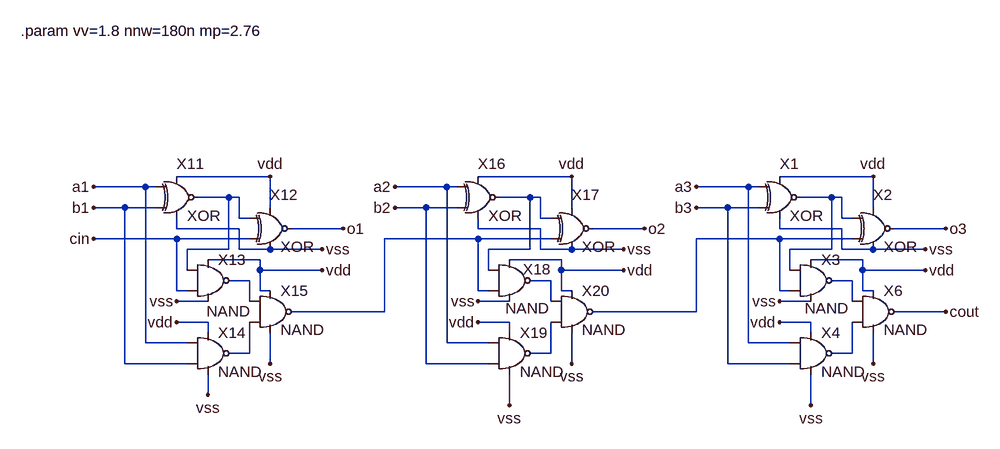
[diagram p0: schematic add3b.asc]
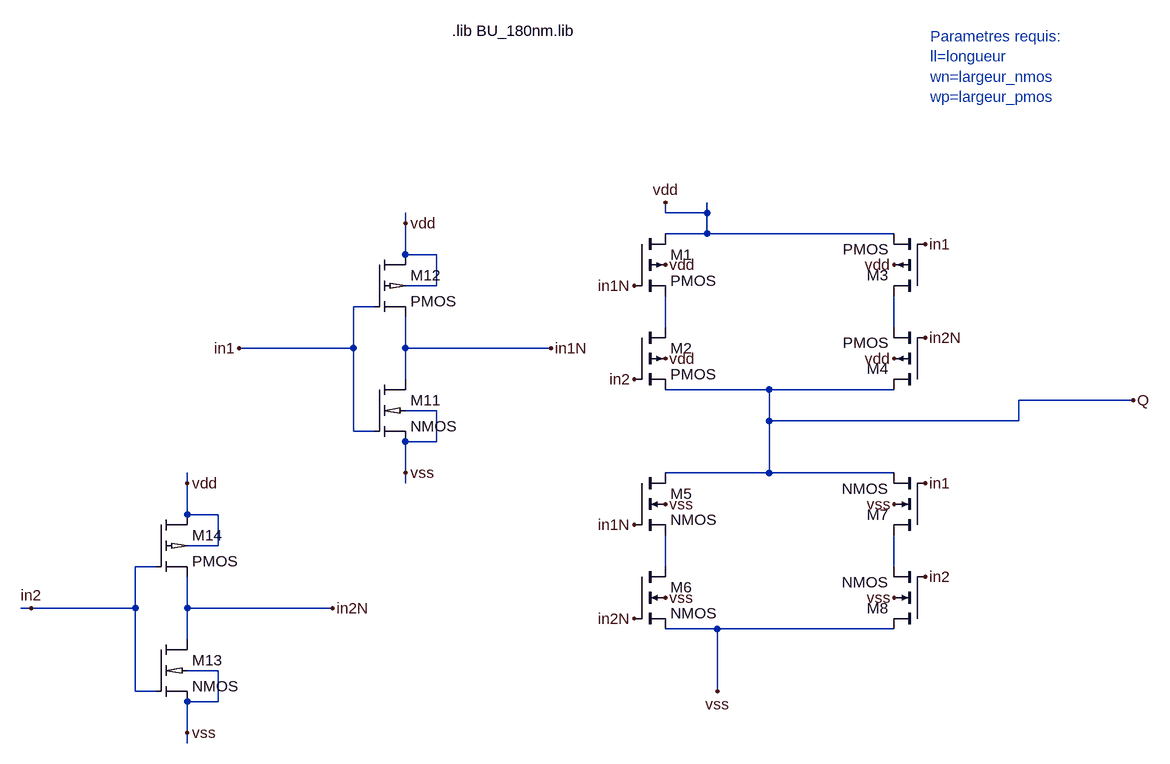
[diagram p1: sub-circuit xor.asc]
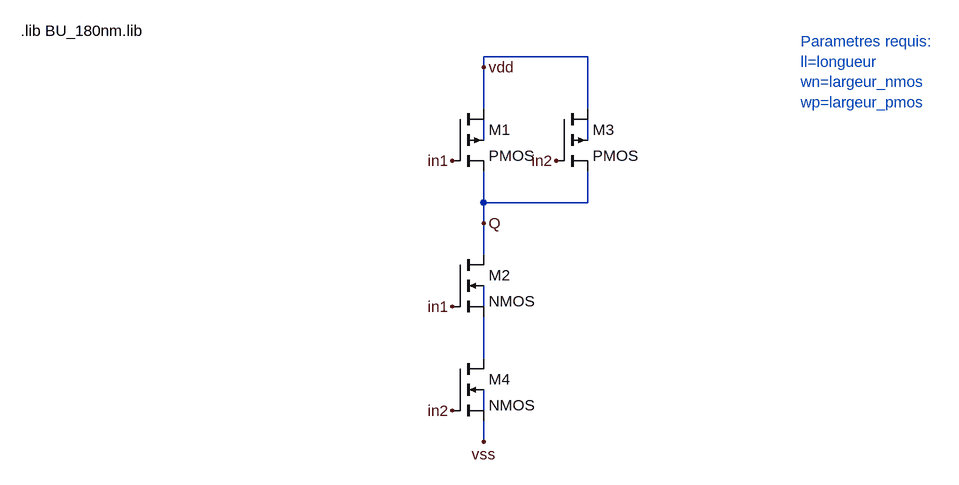
[diagram p2: sub-circuit nand.asc]
add3b.asc, the LTspice schematic file:
Version 4
SHEET 1 2196 1352
WIRE 320 -352 176 -352
WIRE 784 -352 640 -352
WIRE 1248 -352 1104 -352
WIRE 128 -336 48 -336
WIRE 144 -336 128 -336
WIRE 592 -336 512 -336
WIRE 608 -336 592 -336
WIRE 1056 -336 976 -336
WIRE 1072 -336 1056 -336
WIRE 256 -320 208 -320
WIRE 272 -320 256 -320
WIRE 720 -320 672 -320
WIRE 736 -320 720 -320
WIRE 1184 -320 1136 -320
WIRE 1200 -320 1184 -320
WIRE 96 -304 48 -304
WIRE 144 -304 96 -304
WIRE 320 -304 320 -352
WIRE 560 -304 512 -304
WIRE 608 -304 560 -304
WIRE 784 -304 784 -352
WIRE 1024 -304 976 -304
WIRE 1072 -304 1024 -304
WIRE 1248 -304 1248 -352
WIRE 272 -288 272 -320
WIRE 288 -288 272 -288
WIRE 736 -288 736 -320
WIRE 752 -288 736 -288
WIRE 1200 -288 1200 -320
WIRE 1216 -288 1200 -288
WIRE 176 -272 176 -288
WIRE 272 -272 176 -272
WIRE 432 -272 352 -272
WIRE 640 -272 640 -288
WIRE 736 -272 640 -272
WIRE 896 -272 816 -272
WIRE 1104 -272 1104 -288
WIRE 1200 -272 1104 -272
WIRE 1360 -272 1280 -272
WIRE 176 -256 48 -256
WIRE 288 -256 176 -256
WIRE 640 -256 496 -256
WIRE 752 -256 640 -256
WIRE 1104 -256 976 -256
WIRE 1216 -256 1104 -256
WIRE 256 -240 256 -320
WIRE 256 -240 192 -240
WIRE 272 -240 272 -272
WIRE 320 -240 272 -240
WIRE 400 -240 320 -240
WIRE 720 -240 720 -320
WIRE 720 -240 656 -240
WIRE 736 -240 736 -272
WIRE 784 -240 736 -240
WIRE 864 -240 784 -240
WIRE 1184 -240 1184 -320
WIRE 1184 -240 1120 -240
WIRE 1200 -240 1200 -272
WIRE 1248 -240 1200 -240
WIRE 1328 -240 1248 -240
WIRE 304 -224 224 -224
WIRE 768 -224 688 -224
WIRE 1232 -224 1152 -224
WIRE 192 -208 192 -240
WIRE 304 -208 304 -224
WIRE 400 -208 304 -208
WIRE 656 -208 656 -240
WIRE 768 -208 768 -224
WIRE 864 -208 768 -208
WIRE 1120 -208 1120 -240
WIRE 1232 -208 1232 -224
WIRE 1328 -208 1232 -208
WIRE 288 -192 256 -192
WIRE 752 -192 720 -192
WIRE 1216 -192 1184 -192
WIRE 176 -176 176 -256
WIRE 192 -176 176 -176
WIRE 304 -176 304 -208
WIRE 320 -176 304 -176
WIRE 640 -176 640 -256
WIRE 656 -176 640 -176
WIRE 768 -176 768 -208
WIRE 784 -176 768 -176
WIRE 1104 -176 1104 -256
WIRE 1120 -176 1104 -176
WIRE 1232 -176 1232 -208
WIRE 1248 -176 1232 -176
WIRE 224 -160 176 -160
WIRE 288 -160 288 -192
WIRE 688 -160 640 -160
WIRE 752 -160 752 -192
WIRE 1152 -160 1104 -160
WIRE 1216 -160 1216 -192
WIRE 496 -144 496 -256
WIRE 496 -144 352 -144
WIRE 976 -144 976 -256
WIRE 976 -144 816 -144
WIRE 1360 -144 1280 -144
WIRE 224 -128 176 -128
WIRE 688 -128 640 -128
WIRE 1152 -128 1104 -128
WIRE 224 -112 224 -128
WIRE 688 -112 688 -128
WIRE 1152 -112 1152 -128
WIRE 128 -96 128 -336
WIRE 192 -96 128 -96
WIRE 592 -96 592 -336
WIRE 656 -96 592 -96
WIRE 1056 -96 1056 -336
WIRE 1120 -96 1056 -96
WIRE 288 -80 288 -128
WIRE 288 -80 256 -80
WIRE 752 -80 752 -128
WIRE 752 -80 720 -80
WIRE 1216 -80 1216 -128
WIRE 1216 -80 1184 -80
WIRE 96 -64 96 -304
WIRE 192 -64 96 -64
WIRE 320 -64 320 -112
WIRE 560 -64 560 -304
WIRE 656 -64 560 -64
WIRE 784 -64 784 -112
WIRE 1024 -64 1024 -304
WIRE 1120 -64 1024 -64
WIRE 1248 -64 1248 -112
WIRE 224 -16 224 -48
WIRE 688 0 688 -48
WIRE 1152 0 1152 -48
FLAG 1360 -144 cout
FLAG 432 -272 o1
FLAG 896 -272 o2
FLAG 1360 -272 o3
FLAG 976 -336 a3
FLAG 976 -304 b3
FLAG 1248 -352 vdd
FLAG 1328 -208 vdd
FLAG 1104 -128 vdd
FLAG 1152 0 vss
FLAG 1248 -64 vss
FLAG 1104 -160 vss
FLAG 1328 -240 vss
FLAG 48 -336 a1
FLAG 48 -304 b1
FLAG 48 -256 cin
FLAG 320 -352 vdd
FLAG 400 -208 vdd
FLAG 176 -128 vdd
FLAG 224 -16 vss
FLAG 320 -64 vss
FLAG 176 -160 vss
FLAG 400 -240 vss
FLAG 512 -336 a2
FLAG 512 -304 b2
FLAG 784 -352 vdd
FLAG 864 -208 vdd
FLAG 640 -128 vdd
FLAG 688 0 vss
FLAG 784 -64 vss
FLAG 640 -160 vss
FLAG 864 -240 vss
SYMBOL xor 1104 -320 R0
SYMATTR InstName X1
SYMATTR SpiceLine ll=180n wn={nnw} wp={nnw*mp}
SYMBOL xor 1248 -272 R0
SYMATTR InstName X2
SYMATTR SpiceLine ll=180n wn={nnw} wp={nnw*mp}
SYMBOL nand 1152 -192 R0
WINDOW 3 -9 43 Left 2
SYMATTR InstName X3
SYMATTR SpiceLine ll=180n wn={nnw} wp={nnw*mp}
SYMBOL nand 1152 -80 R0
SYMATTR InstName X4
SYMATTR SpiceLine ll=180n wn={nnw} wp={nnw*mp}
SYMBOL nand 1248 -144 R0
SYMATTR InstName X6
SYMATTR SpiceLine ll=180n wn={nnw} wp={nnw*mp}
SYMBOL xor 176 -320 R0
SYMATTR InstName X11
SYMATTR SpiceLine ll=180n wn={nnw} wp={nnw*mp}
SYMBOL xor 320 -272 R0
SYMATTR InstName X12
SYMATTR SpiceLine ll=180n wn={nnw} wp={nnw*mp}
SYMBOL nand 224 -192 R0
WINDOW 3 -2 47 Left 2
SYMATTR InstName X13
SYMATTR SpiceLine ll=180n wn={nnw} wp={nnw*mp}
SYMBOL nand 224 -80 R0
SYMATTR InstName X14
SYMATTR SpiceLine ll=180n wn={nnw} wp={nnw*mp}
SYMBOL nand 320 -144 R0
SYMATTR InstName X15
SYMATTR SpiceLine ll=180n wn={nnw} wp={nnw*mp}
SYMBOL xor 640 -320 R0
SYMATTR InstName X16
SYMATTR SpiceLine ll=180n wn={nnw} wp={nnw*mp}
SYMBOL xor 784 -272 R0
SYMATTR InstName X17
SYMATTR SpiceLine ll=180n wn={nnw} wp={nnw*mp}
SYMBOL nand 688 -192 R0
WINDOW 3 -6 43 Left 2
WINDOW 0 21 -17 Left 2
SYMATTR InstName X18
SYMATTR SpiceLine ll=180n wn={nnw} wp={nnw*mp}
SYMBOL nand 688 -80 R0
SYMATTR InstName X19
SYMATTR SpiceLine ll=180n wn={nnw} wp={nnw*mp}
SYMBOL nand 784 -144 R0
SYMATTR InstName X20
SYMATTR SpiceLine ll=180n wn={nnw} wp={nnw*mp}
TEXT -64 -576 Left 2 !.param vv=1.8 nnw=180n mp=2.76

xor.asc, the sub-circuit schematic file:
Version 4
SHEET 1 1192 964
WIRE 384 80 384 64
WIRE 448 80 448 64
WIRE 448 80 384 80
WIRE -16 96 -16 80
WIRE 448 112 448 80
WIRE 448 112 384 112
WIRE 736 112 448 112
WIRE -16 144 -16 96
WIRE 32 144 -16 144
WIRE 32 192 32 144
WIRE 32 192 -16 192
WIRE -64 224 -96 224
WIRE 384 256 384 208
WIRE 736 256 736 208
WIRE -96 288 -96 224
WIRE -96 288 -272 288
WIRE -16 288 -16 240
WIRE 208 288 -16 288
WIRE -16 336 -16 288
WIRE 544 352 384 352
WIRE 736 352 544 352
WIRE 1104 368 928 368
WIRE 32 384 -16 384
WIRE 544 400 544 352
WIRE 928 400 928 368
WIRE 928 400 544 400
WIRE -96 416 -96 288
WIRE -64 416 -96 416
WIRE 32 432 32 384
WIRE 32 432 -16 432
WIRE -16 480 -16 432
WIRE 544 480 544 400
WIRE 544 480 384 480
WIRE 736 480 544 480
WIRE -352 496 -352 480
WIRE -16 496 -16 480
WIRE -352 544 -352 496
WIRE -304 544 -352 544
WIRE -304 592 -304 544
WIRE -304 592 -352 592
WIRE -400 624 -432 624
WIRE 384 624 384 576
WIRE 736 624 736 576
WIRE -592 688 -608 688
WIRE -432 688 -432 624
WIRE -432 688 -592 688
WIRE -352 688 -352 640
WIRE -128 688 -352 688
WIRE 464 720 384 720
WIRE 736 720 464 720
WIRE -352 736 -352 688
WIRE -304 784 -352 784
WIRE -432 816 -432 688
WIRE -400 816 -432 816
WIRE 464 816 464 720
WIRE -304 832 -304 784
WIRE -304 832 -352 832
WIRE -352 880 -352 832
WIRE -352 896 -352 880
FLAG 336 192 in1N
FLAG 784 272 in2N
FLAG 464 816 vss
FLAG 384 64 vdd
FLAG 1104 368 Q
FLAG 336 560 in1N
FLAG 784 640 in2
FLAG 336 336 in2
FLAG 784 496 in1
FLAG 784 128 in1
FLAG 336 704 in2N
FLAG -272 288 in1
FLAG -16 96 vdd
FLAG -16 480 vss
FLAG 208 288 in1N
FLAG -352 496 vdd
FLAG -352 880 vss
FLAG -128 688 in2N
FLAG -592 688 in2
FLAG 384 160 vdd
FLAG 736 160 vdd
FLAG 736 304 vdd
FLAG 384 304 vdd
FLAG 736 672 vss
FLAG 736 528 vss
FLAG 384 528 vss
FLAG 384 672 vss
SYMBOL pmos4 336 112 R0
SYMATTR InstName M1
SYMATTR Value2 l={ll} w={2*wp} ad={450n*{wp}} as={450n*{wp}} pd={900n+{wp}} ps={1080n+{wp}}
SYMBOL pmos4 336 256 R0
SYMATTR InstName M2
SYMATTR Value2 l={ll} w={2*wp} ad={450n*{wp}} as={450n*{wp}} pd={900n+{wp}} ps={1080n+{wp}}
SYMBOL pmos4 784 208 R180
SYMATTR InstName M3
SYMATTR Value2 l={ll} w={2*wp} ad={450n*{wp}} as={450n*{wp}} pd={900n+{wp}} ps={1080n+{wp}}
SYMBOL pmos4 784 352 R180
SYMATTR InstName M4
SYMATTR Value2 l={ll} w={2*wp} ad={450n*{wp}} as={450n*{wp}} pd={900n+{wp}} ps={1080n+{wp}}
SYMBOL nmos4 336 480 R0
SYMATTR InstName M5
SYMATTR Value2 l={ll} w={2*wn} ad={450n*{wn}} as={450n*{wn}} pd={900n+{wn}} ps={1080n+{wn}}
SYMBOL nmos4 336 624 R0
SYMATTR InstName M6
SYMATTR Value2 l={ll} w={2*wn} ad={450n*{wn}} as={450n*{wn}} pd={900n+{wn}} ps={1080n+{wn}}
SYMBOL nmos4 784 576 R180
SYMATTR InstName M7
SYMATTR Value2 l={ll} w={2*wn} ad={450n*{wn}} as={450n*{wn}} pd={900n+{wn}} ps={1080n+{wn}}
SYMBOL nmos4 784 720 R180
SYMATTR InstName M8
SYMATTR Value2 l={ll} w={2*wn} ad={450n*{wn}} as={450n*{wn}} pd={900n+{wn}} ps={1080n+{wn}}
SYMBOL nmos018 -64 336 R0
SYMATTR InstName M11
SYMATTR Value2 l={ll} w={wn} ad={450n*{wn}} as={450n*{wn}} pd={900n+{wn}} ps={1080n+{wn}}
SYMBOL pmos018 -64 144 R0
SYMATTR InstName M12
SYMATTR Value2 l={ll} w={wp} ad={450n*{wp}} as={450n*{wp}} pd={900n+{wp}} ps={1080n+{wp}}
SYMBOL nmos018 -400 736 R0
SYMATTR InstName M13
SYMATTR Value2 l={ll} w={wn} ad={450n*{wn}} as={450n*{wn}} pd={900n+{wn}} ps={1080n+{wn}}
SYMBOL pmos018 -400 544 R0
SYMATTR InstName M14
SYMATTR Value2 l={ll} w={wp} ad={450n*{wp}} as={450n*{wp}} pd={900n+{wp}} ps={1080n+{wp}}
TEXT 56 -200 Left 2 !.lib BU_180nm.lib
TEXT 792 -192 Left 2 ;Parametres requis: \nll=longueur \nwn=largeur_nmos \nwp=largeur_pmos

nand.asc, the sub-circuit schematic file:
Version 4
SHEET 1 1192 836
WIRE 608 160 448 160
WIRE 448 176 448 160
WIRE 448 240 448 176
WIRE 608 240 608 160
WIRE 448 288 448 256
WIRE 608 288 608 256
WIRE 448 384 448 336
WIRE 608 384 608 336
WIRE 608 384 448 384
WIRE 448 416 448 384
WIRE 448 464 448 416
WIRE 448 544 448 512
WIRE 448 624 448 560
WIRE 448 704 448 672
WIRE 448 752 448 720
FLAG 448 176 vdd
FLAG 448 416 Q
FLAG 400 320 in1
FLAG 560 320 in2
FLAG 400 544 in1
FLAG 400 704 in2
FLAG 448 752 vss
SYMBOL pmos4 400 240 R0
SYMATTR InstName M1
SYMATTR Value2 l={ll} w={wp} ad={450n*{wp}} as={450n*{wp}} pd={900n+{wp}} ps={1080n+{wp}}
SYMBOL pmos4 560 240 R0
SYMATTR InstName M3
SYMATTR Value2 l={ll} w={wp} ad={450n*{wp}} as={450n*{wp}} pd={900n+{wp}} ps={1080n+{wp}}
SYMBOL nmos4 400 464 R0
SYMATTR InstName M2
SYMATTR Value2 l={ll} w={2*wn} ad={450n*{wn}} as={450n*{wn}} pd={900n+{wn}} ps={1080n+{wn}}
SYMBOL nmos4 400 624 R0
SYMATTR InstName M4
SYMATTR Value2 l={ll} w={2*wn} ad={450n*{wn}} as={450n*{wn}} pd={900n+{wn}} ps={1080n+{wn}}
TEXT -264 120 Left 2 !.lib BU_180nm.lib
TEXT 936 136 Left 2 ;Parametres requis: \nll=longueur \nwn=largeur_nmos \nwp=largeur_pmos

The netlist it stands for:
* add3b.asc
XX1 a3 N003 vdd vss b3 xor params: XOR ll=180n wn={nnw} wp={nnw*mp}
XX2 N003 o3 vdd vss N005 xor params: XOR ll=180n wn={nnw} wp={nnw*mp}
XX3 N003 N008 vdd vss N005 nand params: NAND ll=180n wn={nnw} wp={nnw*mp}
XX4 a3 N011 vdd vss b3 nand params: NAND ll=180n wn={nnw} wp={nnw*mp}
XX6 N008 cout vdd vss N011 nand params: NAND ll=180n wn={nnw} wp={nnw*mp}
XX11 a1 N001 vdd vss b1 xor params: XOR ll=180n wn={nnw} wp={nnw*mp}
XX12 N001 o1 vdd vss cin xor params: XOR ll=180n wn={nnw} wp={nnw*mp}
XX13 N001 N006 vdd vss cin nand params: NAND ll=180n wn={nnw} wp={nnw*mp}
XX14 a1 N009 vdd vss b1 nand params: NAND ll=180n wn={nnw} wp={nnw*mp}
XX15 N006 N004 vdd vss N009 nand params: NAND ll=180n wn={nnw} wp={nnw*mp}
XX16 a2 N002 vdd vss b2 xor params: XOR ll=180n wn={nnw} wp={nnw*mp}
XX17 N002 o2 vdd vss N004 xor params: XOR ll=180n wn={nnw} wp={nnw*mp}
XX18 N002 N007 vdd vss N004 nand params: NAND ll=180n wn={nnw} wp={nnw*mp}
XX19 a2 N010 vdd vss b2 nand params: NAND ll=180n wn={nnw} wp={nnw*mp}
XX20 N007 N005 vdd vss N010 nand params: NAND ll=180n wn={nnw} wp={nnw*mp}

* block symbol definitions
.subckt xor in1 Q vdd vss in2
M1 vdd in1N N001 vdd PMOS l={ll} w={2*wp} ad={450n*{wp}} as={450n*{wp}} pd={900n+{wp}} ps={1080n+{wp}}
M2 N001 in2 Q vdd PMOS l={ll} w={2*wp} ad={450n*{wp}} as={450n*{wp}} pd={900n+{wp}} ps={1080n+{wp}}
M3 N002 in1 vdd vdd PMOS l={ll} w={2*wp} ad={450n*{wp}} as={450n*{wp}} pd={900n+{wp}} ps={1080n+{wp}}
M4 Q in2N N002 vdd PMOS l={ll} w={2*wp} ad={450n*{wp}} as={450n*{wp}} pd={900n+{wp}} ps={1080n+{wp}}
M5 Q in1N N003 vss NMOS l={ll} w={2*wn} ad={450n*{wn}} as={450n*{wn}} pd={900n+{wn}} ps={1080n+{wn}}
M6 N003 in2N vss vss NMOS l={ll} w={2*wn} ad={450n*{wn}} as={450n*{wn}} pd={900n+{wn}} ps={1080n+{wn}}
M7 N004 in1 Q vss NMOS l={ll} w={2*wn} ad={450n*{wn}} as={450n*{wn}} pd={900n+{wn}} ps={1080n+{wn}}
M8 vss in2 N004 vss NMOS l={ll} w={2*wn} ad={450n*{wn}} as={450n*{wn}} pd={900n+{wn}} ps={1080n+{wn}}
M11 in1N in1 vss vss NMOS l={ll} w={wn} ad={450n*{wn}} as={450n*{wn}} pd={900n+{wn}} ps={1080n+{wn}}
M12 vdd in1 in1N vdd PMOS l={ll} w={wp} ad={450n*{wp}} as={450n*{wp}} pd={900n+{wp}} ps={1080n+{wp}}
M13 in2N in2 vss vss NMOS l={ll} w={wn} ad={450n*{wn}} as={450n*{wn}} pd={900n+{wn}} ps={1080n+{wn}}
M14 vdd in2 in2N vdd PMOS l={ll} w={wp} ad={450n*{wp}} as={450n*{wp}} pd={900n+{wp}} ps={1080n+{wp}}
.lib BU_180nm.lib
* Parametres requis:
* ll=longueur
* wn=largeur_nmos
* wp=largeur_pmos
.ends xor

.subckt nand in1 Q vdd vss in2
M1 vdd in1 Q N001 PMOS l={ll} w={wp} ad={450n*{wp}} as={450n*{wp}} pd={900n+{wp}} ps={1080n+{wp}}
M3 vdd in2 Q N002 PMOS l={ll} w={wp} ad={450n*{wp}} as={450n*{wp}} pd={900n+{wp}} ps={1080n+{wp}}
M2 Q in1 N004 N003 NMOS l={ll} w={2*wn} ad={450n*{wn}} as={450n*{wn}} pd={900n+{wn}} ps={1080n+{wn}}
M4 N004 in2 vss N005 NMOS l={ll} w={2*wn} ad={450n*{wn}} as={450n*{wn}} pd={900n+{wn}} ps={1080n+{wn}}
.lib BU_180nm.lib
* Parametres requis:
* ll=longueur
* wn=largeur_nmos
* wp=largeur_pmos
.ends nand

.model NMOS NMOS
.model PMOS PMOS
.lib standard.mos
.param vv=1.8 nnw=180n mp=2.76
.lib BU_180nm.lib
.backanno
.end